# EAGLE design 23XXAdapter (EAGLE 7.7.0)
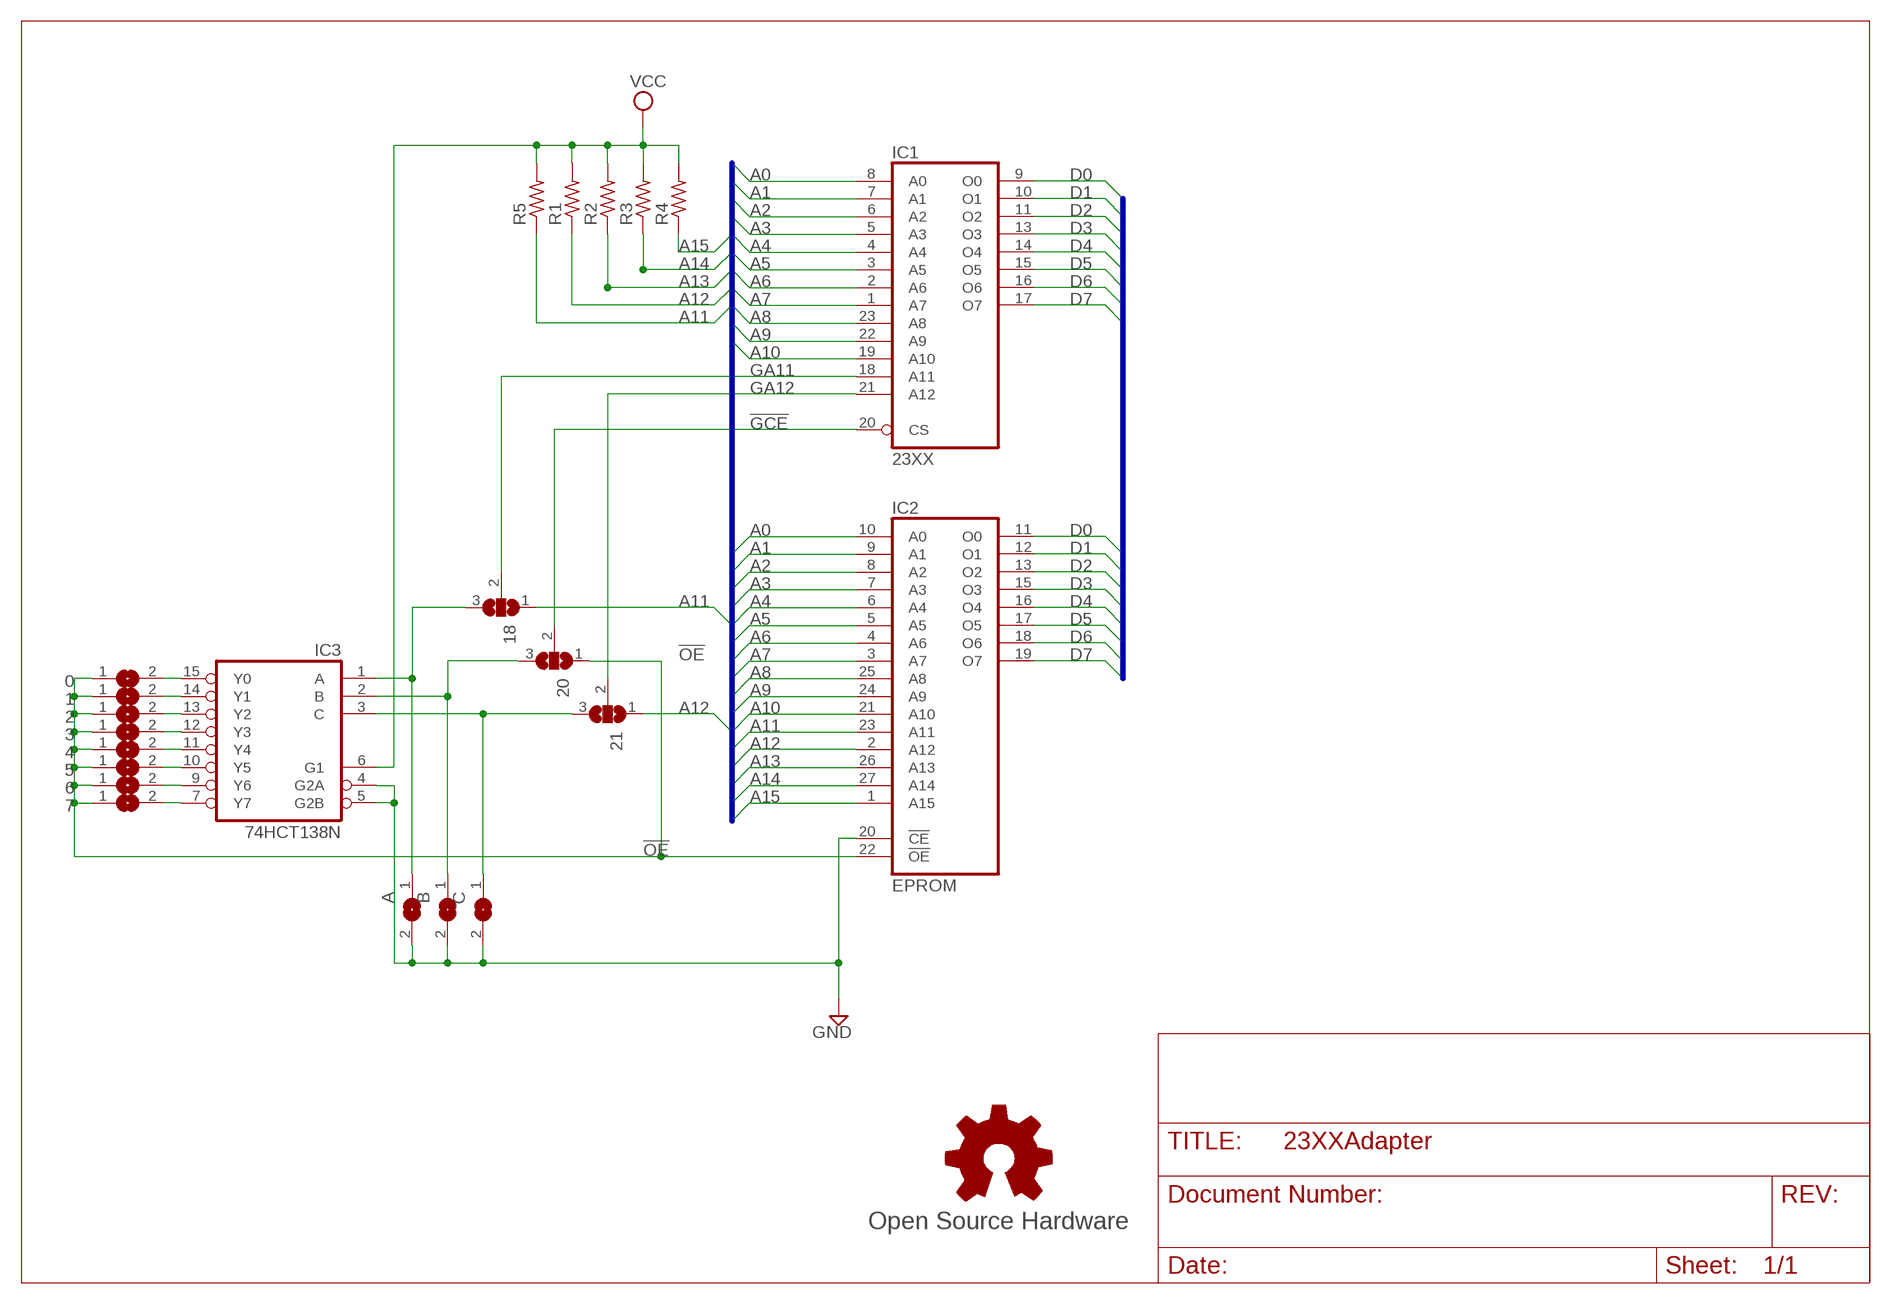
[diagram p0: schematic, sheet 1]

## Parts
0  SJ  [SJ]
1  SJ  [SJ]
2  SJ  [SJ]
3  SJ  [SJ]
4  SJ  [SJ]
5  SJ  [SJ]
6  SJ  [SJ]
7  SJ  [SJ]
18  SJ2W  [SJ_2]
20  SJ2W  [SJ_2]
21  SJ2W  [SJ_2]
A  SJ  [SJ]
B  SJ  [SJ]
C  SJ  [SJ]
GOLD_ORB_SM1  Open Source Hardware  OSHWLOGOLOGO5MM  [OSHW_5MM]
IC1  23XX  2364'RD'  [DIL24-ROUNDPAD]
IC2  EPROM  27512'RD'  [DIL28-ROUNDPAD]
IC3  74HCT138N  74LS138N  [DIL16]
R1  R-US_0204/5  [0204/5]
R2  R-US_0204/5  [0204/5]
R3  R-US_0204/5  [0204/5]
R4  R-US_0204/5  [0204/5]
R5  R-US_0204/5  [0204/5]

## Nets
!GCE: 20.2 IC1.20(CS)
!OE: 0.1 1.1 2.1 3.1 4.1 5.1 6.1 7.1 20.1 IC2.22(!OE)
A0: IC1.8(A0) IC2.10(A0)
A1: IC1.7(A1) IC2.9(A1)
A2: IC1.6(A2) IC2.8(A2)
A3: IC1.5(A3) IC2.7(A3)
A4: IC1.4(A4) IC2.6(A4)
A5: IC1.3(A5) IC2.5(A5)
A6: IC1.2(A6) IC2.4(A6)
A7: IC1.1(A7) IC2.3(A7)
A8: IC1.23(A8) IC2.25(A8)
A9: IC1.22(A9) IC2.24(A9)
A10: IC1.19(A10) IC2.21(A10)
A11: 18.1 IC2.23(A11) R5.1
A12: 21.1 IC2.2(A12) R1.1
A13: IC2.26(A13) R2.1
A14: IC2.27(A14) R3.1
A15: IC2.1(A15) R4.1
D0: IC1.9(O0) IC2.11(O0)
D1: IC1.10(O1) IC2.12(O1)
D2: IC1.11(O2) IC2.13(O2)
D3: IC1.13(O3) IC2.15(O3)
D4: IC1.14(O4) IC2.16(O4)
D5: IC1.15(O5) IC2.17(O5)
D6: IC1.16(O6) IC2.18(O6)
D7: IC1.17(O7) IC2.19(O7)
GA11: 18.2 IC1.18(A11)
GA12: 21.2 IC1.21(A12)
GND: A.2 B.2 C.2 IC2.20(!CE) IC3.4(G2A) IC3.5(G2B)
N$1: 20.3 B.1 IC3.2(B)
N$4: 0.2 IC3.15(Y0)
N$6: 1.2 IC3.14(Y1)
N$7: 2.2 IC3.13(Y2)
N$8: 3.2 IC3.12(Y3)
N$9: 4.2 IC3.11(Y4)
N$10: 5.2 IC3.10(Y5)
N$11: 6.2 IC3.9(Y6)
N$12: 7.2 IC3.7(Y7)
N$13: 21.3 C.1 IC3.3(C)
N$16: 18.3 A.1 IC3.1(A)
VCC: IC3.6(G1) R1.2 R2.2 R3.2 R4.2 R5.2

## Buses
A[0..15]
D[0..7]

## Power pins joined to a net without a drawn wire
GND: IC1.12(GND) IC2.14(GND) IC3.8(GND)
VCC: IC1.24(VCC) IC2.28(VCC) IC3.16(VCC)

## Library data of the parts
0 1-7 A B C = jumper:SJ: SMD solder JUMPER
18 20 21 = jumper:SJ2W: SMD solder JUMPER
GOLD_ORB_SM1 = oshw:OSHWLOGO: The OSHW logo for PCB layout
IC1 = 0RB_Memory:2364: ROM used by Commodore
IC2 = 0RB_Memory:27512
IC3 = 74xx-us:74*138: 3-line to 8-line DECODER/DEMULTIPLEXER
R1-R5 = resistor:R-US_: RESISTOR, American symbol

## Board
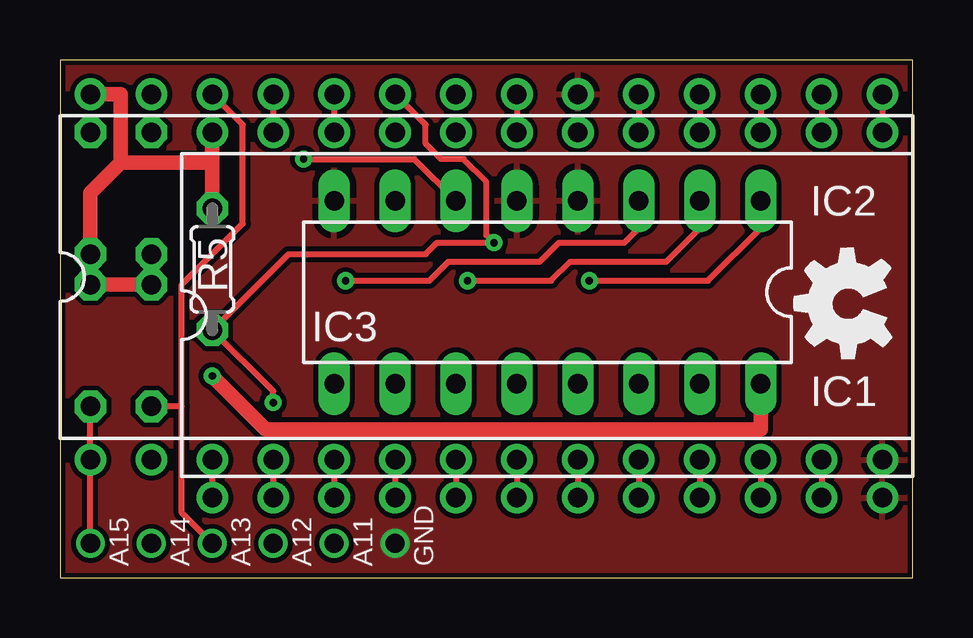
[diagram p1: board, top side]
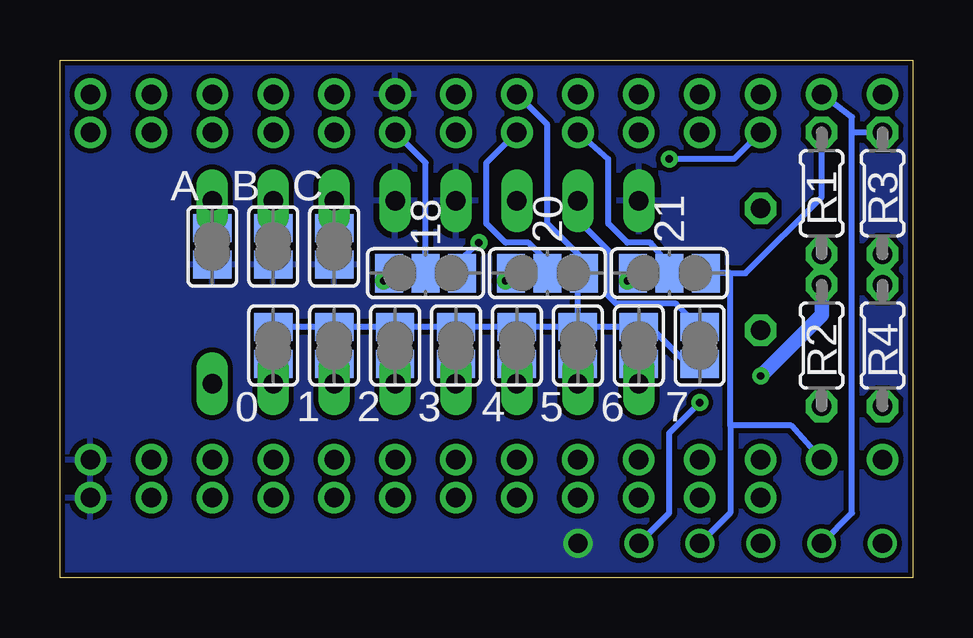
[diagram p2: board, bottom side, seen from below]

Size 35.56 x 21.59 mm. Coordinates in mm from the lower left corner, seen from the top.
Outline: 35.56,0 35.56,21.59 0,21.59 0.01,0 35.56,0
Copper layers (1*16): Top 0.035mm / dielectric 1.5mm / Bottom 0.035mm
Design rules "default *": minimum track width 10mil, minimum drill 24mil, track to track 8mil, track to pad 8mil, pad to pad 8mil, via to via 8mil, smd to smd 8mil, copper to edge 8mil, drill to drill 8mil, minimum pad ring 10mil, minimum via ring 8mil, stop-mask expansion 4mil, vias tented up to drill 0mil, thermal gap 10mil

### Footprints (pad centres in the part's own frame; a part is rotated, then mirrored left to right if it is on the bottom)
SJ = smd 1.168 x 1.6: 1 -0.762,0; 2 0.762,0
SJ_2 = smd 1.168 x 1.6: 1 -1.524,0; 2 0,0; 3 1.524,0
DIL24-ROUNDPAD = drill 0.813: 1 -13.97,-7.62; 2 -11.43,-7.62; 3 -8.89,-7.62; 4 -6.35,-7.62; 5 -3.81,-7.62; 6 -1.27,-7.62; 7 1.27,-7.62; 8 3.81,-7.62; 9 6.35,-7.62; 10 8.89,-7.62; 11 11.43,-7.62; 12 13.97,-7.62; 13 13.97,7.62; 14 11.43,7.62; 15 8.89,7.62; 16 6.35,7.62; 17 3.81,7.62; 18 1.27,7.62; 19 -1.27,7.62; 20 -3.81,7.62; 21 -6.35,7.62; 22 -8.89,7.62; 23 -11.43,7.62; 24 -13.97,7.62
DIL28-ROUNDPAD = drill 0.813: 1 -16.51,-7.62; 2 -13.97,-7.62; 3 -11.43,-7.62; 4 -8.89,-7.62; 5 -6.35,-7.62; 6 -3.81,-7.62; 7 -1.27,-7.62; 8 1.27,-7.62; 9 3.81,-7.62; 10 6.35,-7.62; 11 8.89,-7.62; 12 11.43,-7.62; 13 13.97,-7.62; 14 16.51,-7.62; 15 16.51,7.62; 16 13.97,7.62; 17 11.43,7.62; 18 8.89,7.62; 19 6.35,7.62; 20 3.81,7.62; 21 1.27,7.62; 22 -1.27,7.62; 23 -3.81,7.62; 24 -6.35,7.62; 25 -8.89,7.62; 26 -11.43,7.62; 27 -13.97,7.62; 28 -16.51,7.62
DIL16 = drill 0.813 long: 1 -8.89,-3.81; 2 -6.35,-3.81; 3 -3.81,-3.81; 4 -1.27,-3.81; 5 1.27,-3.81; 6 3.81,-3.81; 7 6.35,-3.81; 8 8.89,-3.81; 9 8.89,3.81; 10 6.35,3.81; 11 3.81,3.81; 12 1.27,3.81; 13 -1.27,3.81; 14 -3.81,3.81; 15 -6.35,3.81; 16 -8.89,3.81
0204/5 = drill 0.813 octagon: 1 -2.54,0; 2 2.54,0

### Placement (x,y rotation side)
0  26.67,9.68 270 bottom
1  24.13,9.68 270 bottom
2  21.59,9.68 270 bottom
3  19.05,9.68 270 bottom
4  16.51,9.68 270 bottom
5  13.97,9.68 270 bottom
6  11.43,9.68 270 bottom
7  8.89,9.68 90 bottom
18  20.32,12.7 180 bottom
20  15.24,12.7 180 bottom
21  10.16,12.7 180 bottom
A  29.21,13.81 270 bottom
B  26.67,13.81 270 bottom
C  24.13,13.81 270 bottom
GOLD_ORB_SM1  32.86,11.43 90 top
IC1  20.32,10.95 0 top
IC2  17.78,12.54 0 top
IC3  20.32,11.91 180 top
R1  3.81,16.03 270 bottom
R2  3.81,9.68 90 bottom
R3  1.27,16.03 270 bottom
R4  1.27,9.68 90 bottom
R5  6.35,12.86 90 top

### Tracks (layer width: path | path; a pad name or v marks a point on that pad's centre or on a via)
!GCE
  Bottom 0.254: IC1.20 17.78,17.3 17.78,14.76 16.99,13.97 16.03,13.97 15.24,13.18 15.24,13.02 20.2
!OE
  Bottom 0.254: 0.1 1.1 2.1 3.1 4.1 5.1 | 5.1 6.1 11.3,10.32 10.79,10.32 9.4,8.92 7.1 | IC2.22 15.24,18.89 15.24,14.76 13.72,13.24 20.1 13.97,12.61 5.1
A0
  Top 0.254: IC2.10 IC1.8
A1
  Top 0.254: IC2.9 IC1.7
A2
  Top 0.254: IC2.8 IC1.6
A3
  Top 0.254: IC2.7 IC1.5
A4
  Top 0.254: IC2.6 IC1.4
A5
  Top 0.254: IC2.5 IC1.3
A6
  Top 0.254: IC2.4 IC1.2
A7
  Top 0.254: IC2.3 IC1.1
A8
  Top 0.254: IC2.25 IC1.23
A9
  Top 0.254: IC2.24 IC1.22
A10
  Top 0.254: IC2.21 IC1.19
A11  (via drill 0.3, 0.8)
  Top 0.254: IC2.23 15.24,18.89 15.24,18.1 15.88,17.46 16.83,17.46 17.78,16.51 17.78,14.29 v18.1,13.97 15.72,13.97 15.24,13.49 9.53,13.49 R5.1 8.89,7.78 v8.89,7.3
  Bottom 0.254: 18.1 18.73,13.4 v18.1,13.97 | v11.43,1.43 10.16,2.7 10.16,6.03 v8.89,7.3
A12  (via drill 0.8)
  Bottom 0.254: R1.1 3.81,15.88 6.99,12.7 7.62,12.7 | 7.62,6.35 5.08,6.35 IC2.2 | 7.62,6.35 7.62,12.7 | v8.89,1.43 7.62,2.7 7.62,6.35 | 21.1 7.78,12.7 7.62,12.7
A13  (via drill 0.8)
  Top 0.254: IC2.26 7.62,18.89 7.62,14.76 5.08,12.22 5.08,7.14 | 5.08,7.14 5.08,2.7 v6.35,1.43 | 5.08,7.14 R2.1
A14  (via drill 0.8)
  Bottom 0.254: IC2.27 2.54,19.21 2.54,18.57 | 2.54,18.57 2.54,2.7 v3.81,1.43 | 2.54,18.57 R3.1
A15  (via drill 0.8)
  Top 0.254: v1.27,1.43 IC2.1 R4.1
D0
  Top 0.254: IC2.11 IC1.9
D1
  Top 0.254: IC2.12 IC1.10
D2
  Top 0.254: IC2.13 IC1.11
D3
  Top 0.254: IC2.15 IC1.13
D4
  Top 0.254: IC2.16 IC1.14
D5
  Top 0.254: IC2.17 IC1.15
D6
  Top 0.254: IC2.18 IC1.16
D7
  Top 0.254: IC2.19 IC1.17
GA11
  Bottom 0.254: IC1.18 20.32,17.3 18.2
GA12
  Bottom 0.254: IC1.21 12.7,17.46 12.7,14.76 11.91,13.97 10.95,13.97 10.16,13.02 21.2
GND  (via drill 0.8)
  other vias: 13.97,1.43
  pour Top: 0,0 0,21.59 35.56,21.59 35.56,0
  pour Bottom: 0,0 0,21.59 35.56,21.59 35.56,0
N$1  (via drill 0.3)
  Top 0.254: v16.99,12.38 20.48,12.38 21.27,13.18 25.27,13.18 B.1 IC3.2 | IC3.2
  Bottom 0.254: IC3.2 | IC3.2 B.1 | v16.99,12.38 20.3
N$2
  Bottom 0.152: 13.65,12.7 15.24,12.7
N$3
  Bottom 0.152: 8.57,12.7 10,12.7
N$4
  Bottom 0.254: 0.2 IC3.15
N$5
  Bottom 0.152: 18.73,12.7 20.32,12.7
N$6
  Bottom 0.254: 1.2 IC3.14
N$7
  Bottom 0.254: 2.2 IC3.13
N$8
  Bottom 0.254: 3.2 IC3.12
N$9
  Bottom 0.254: 4.2 IC3.11
N$10
  Bottom 0.254: 5.2 IC3.10
N$11
  Bottom 0.254: 6.2 IC3.9
N$12
  Bottom 0.254: 7.2 9.87,11.43 12.38,11.43 12.7,11.75 12.7,13.65 13.97,14.92 IC3.7
N$13  (via drill 0.3)
  Top 0.254: v11.91,12.38 15.4,12.38 16.19,13.18 20,13.18 20.8,13.97 23.53,13.97 C.1 IC3.3 | IC3.3
  Bottom 0.254: IC3.3 | IC3.3 C.1 | v11.91,12.38 21.3
N$16  (via drill 0.3)
  Top 0.254: v22.07,12.38 27.02,12.38 A.1 IC3.1 | IC3.1
  Bottom 0.254: IC3.1 | IC3.1 A.1 | v22.07,12.38 18.3
VCC  (via drill 0.3)
  Top 0.254: IC3.6 | IC3.6 14.76,17.46 v10.16,17.46
  Top 0.406: 6.35,17.3 6.35,15.72
  Top 0.61: 2.54,17.3 6.35,17.3 | IC1.24 6.35,15.72 R5.2 | IC2.28 2.54,20.16 2.54,17.3 | 2.54,17.3 1.27,16.03 R3.2 R4.2 R2.2 R1.2 | IC3.16 29.21,6.19 8.57,6.19 v6.35,8.41
  Bottom 0.254: v10.16,17.46 7.46,17.46 IC1.24
  Bottom 0.61: v6.35,8.41 3.81,10.95 R2.2

### Text on the board
tNames: A15 | A14 | A13 | A12 | A11 | GND
tValues: (c) 2012 RETRO Innovations | www.go4retro.com
bTest: 1 | 2 | 3 | 1 | 2 | 3 | 1 | 2 | 3